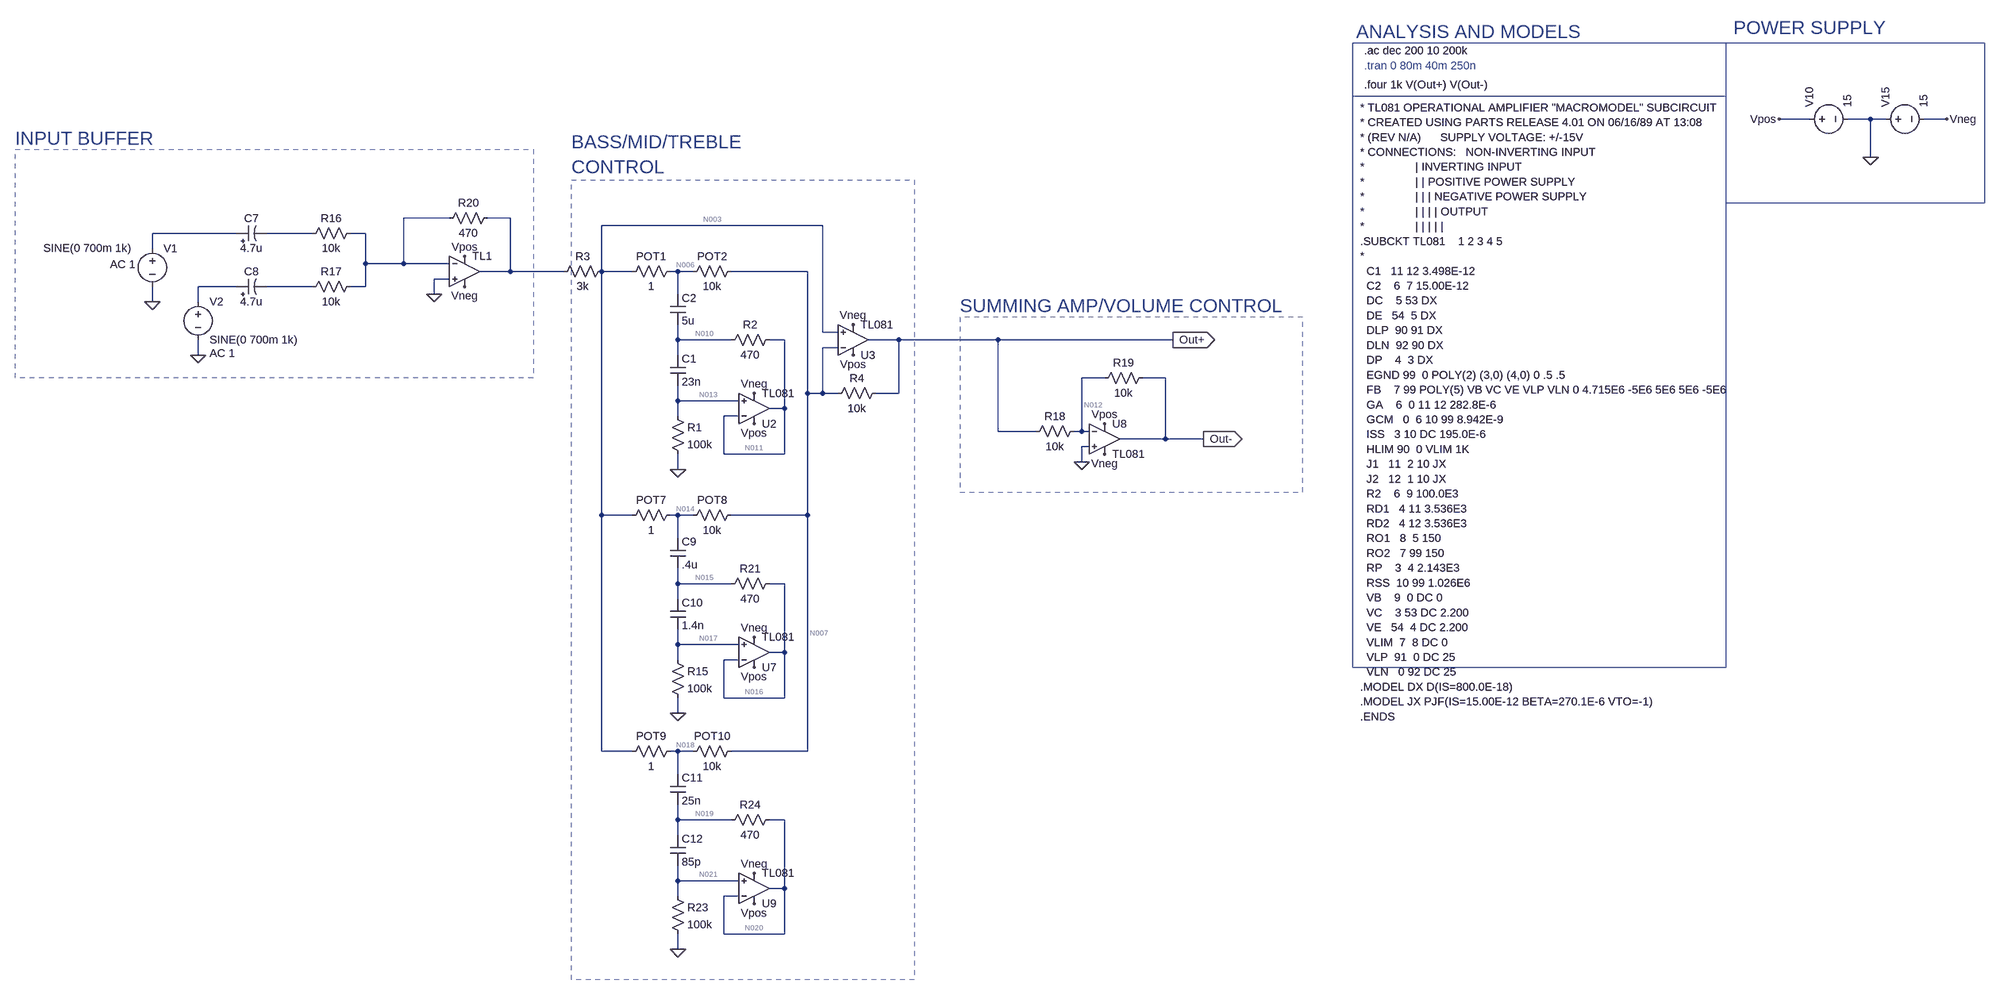
[diagram p0: schematic Equaliser.asc]
Equaliser.asc, the LTspice schematic file:
Version 4.1
SHEET 1 4836 2132
WIRE 4464 -336 4400 -336
WIRE 4592 -336 4544 -336
WIRE 4624 -336 4592 -336
WIRE 4752 -336 4704 -336
WIRE 4592 -256 4592 -336
WIRE 1152 -128 1056 -128
WIRE 1280 -128 1232 -128
WIRE 1936 -112 1472 -112
WIRE 704 -96 528 -96
WIRE 864 -96 768 -96
WIRE 976 -96 944 -96
WIRE 528 -64 528 -96
WIRE 976 -32 976 -96
WIRE 1056 -32 1056 -128
WIRE 1056 -32 976 -32
WIRE 1152 -32 1056 -32
WIRE 1280 -16 1280 -128
WIRE 1280 -16 1216 -16
WIRE 1392 -16 1280 -16
WIRE 1472 -16 1472 -112
WIRE 1536 -16 1472 -16
WIRE 1632 -16 1616 -16
WIRE 1664 -16 1632 -16
WIRE 1904 -16 1744 -16
WIRE 1152 0 1120 0
WIRE 704 16 624 16
WIRE 864 16 768 16
WIRE 976 16 976 -32
WIRE 976 16 944 16
WIRE 1120 32 1120 0
WIRE 1632 32 1632 -16
WIRE 528 48 528 16
WIRE 624 48 624 16
WIRE 1936 112 1936 -112
WIRE 1968 112 1936 112
WIRE 1632 128 1632 96
WIRE 1744 128 1632 128
WIRE 1856 128 1824 128
WIRE 2096 128 2032 128
WIRE 2304 128 2096 128
WIRE 2672 128 2304 128
WIRE 1968 144 1936 144
WIRE 624 160 624 128
WIRE 1632 160 1632 128
WIRE 2528 208 2480 208
WIRE 2656 208 2608 208
WIRE 1904 240 1904 -16
WIRE 1936 240 1936 144
WIRE 1936 240 1904 240
WIRE 1968 240 1936 240
WIRE 2096 240 2096 128
WIRE 2096 240 2048 240
WIRE 1632 256 1632 224
WIRE 1760 256 1632 256
WIRE 1856 272 1856 128
WIRE 1856 272 1824 272
WIRE 1632 288 1632 256
WIRE 1760 288 1728 288
WIRE 2304 320 2304 128
WIRE 2384 320 2304 320
WIRE 2480 320 2480 208
WIRE 2480 320 2464 320
WIRE 2496 320 2480 320
WIRE 2656 336 2656 208
WIRE 2656 336 2560 336
WIRE 2736 336 2656 336
WIRE 2496 352 2480 352
WIRE 1728 368 1728 288
WIRE 1856 368 1856 272
WIRE 1856 368 1728 368
WIRE 2480 384 2480 352
WIRE 1632 400 1632 368
WIRE 1472 496 1472 -16
WIRE 1536 496 1472 496
WIRE 1632 496 1616 496
WIRE 1664 496 1632 496
WIRE 1904 496 1904 240
WIRE 1904 496 1744 496
WIRE 1632 544 1632 496
WIRE 1632 640 1632 608
WIRE 1744 640 1632 640
WIRE 1856 640 1824 640
WIRE 1632 672 1632 640
WIRE 1632 768 1632 736
WIRE 1760 768 1632 768
WIRE 1856 784 1856 640
WIRE 1856 784 1824 784
WIRE 1632 800 1632 768
WIRE 1760 800 1728 800
WIRE 1728 880 1728 800
WIRE 1856 880 1856 784
WIRE 1856 880 1728 880
WIRE 1632 912 1632 880
WIRE 1472 992 1472 496
WIRE 1536 992 1472 992
WIRE 1632 992 1616 992
WIRE 1664 992 1632 992
WIRE 1904 992 1904 496
WIRE 1904 992 1744 992
WIRE 1632 1040 1632 992
WIRE 1632 1136 1632 1104
WIRE 1744 1136 1632 1136
WIRE 1856 1136 1824 1136
WIRE 1632 1168 1632 1136
WIRE 1632 1264 1632 1232
WIRE 1760 1264 1632 1264
WIRE 1856 1280 1856 1136
WIRE 1856 1280 1824 1280
WIRE 1632 1296 1632 1264
WIRE 1760 1296 1728 1296
WIRE 1728 1376 1728 1296
WIRE 1856 1376 1856 1280
WIRE 1856 1376 1728 1376
WIRE 1632 1408 1632 1376
FLAG 1632 400 0
FLAG 4592 -256 0
FLAG 4400 -336 Vpos
FLAG 4752 -336 Vneg
FLAG 1792 240 Vneg
FLAG 2000 96 Vneg
FLAG 1792 304 Vpos
FLAG 2000 160 Vpos
FLAG 2672 128 Out+
IOPIN 2672 128 Out
FLAG 2736 336 Out-
IOPIN 2736 336 Out
FLAG 2528 304 Vpos
FLAG 2528 368 Vneg
FLAG 2480 384 0
FLAG 528 48 0
FLAG 624 160 0
FLAG 1120 32 0
FLAG 1184 -48 Vpos
FLAG 1184 16 Vneg
FLAG 1632 912 0
FLAG 1792 752 Vneg
FLAG 1792 816 Vpos
FLAG 1632 1408 0
FLAG 1792 1248 Vneg
FLAG 1792 1312 Vpos
SYMBOL res 1488 -32 R90
WINDOW 0 0 56 VBottom 2
WINDOW 3 32 56 VTop 2
SYMATTR InstName R3
SYMATTR Value 3k
SYMBOL res 1632 -32 R90
WINDOW 0 0 56 VBottom 2
WINDOW 3 32 56 VTop 2
SYMATTR InstName POT1
SYMATTR Value 1
SYMBOL res 1760 -32 R90
WINDOW 0 0 56 VBottom 2
WINDOW 3 32 56 VTop 2
SYMATTR InstName POT2
SYMATTR Value 10k
SYMBOL cap 1616 32 R0
SYMATTR InstName C2
SYMATTR Value 5u
SYMBOL cap 1616 160 R0
SYMATTR InstName C1
SYMATTR Value 23n
SYMBOL res 1616 272 R0
SYMATTR InstName R1
SYMATTR Value 100k
SYMBOL res 1840 112 R90
WINDOW 0 0 56 VBottom 2
WINDOW 3 32 56 VTop 2
SYMATTR InstName R2
SYMATTR Value 470
SYMBOL res 2064 224 R90
WINDOW 0 0 56 VBottom 2
WINDOW 3 32 56 VTop 2
SYMATTR InstName R4
SYMATTR Value 10k
SYMBOL OpAmps\\opamp2 1792 336 M180
SYMATTR InstName U2
SYMATTR Value TL081
SYMBOL OpAmps\\opamp2 2000 192 M180
SYMATTR InstName U3
SYMATTR Value TL081
SYMBOL voltage 4448 -336 R270
WINDOW 123 0 0 Left 0
WINDOW 39 0 0 Left 0
SYMATTR InstName V10
SYMATTR Value 15
SYMBOL voltage 4608 -336 R270
WINDOW 123 0 0 Left 0
WINDOW 39 0 0 Left 0
SYMATTR InstName V15
SYMATTR Value 15
SYMBOL OpAmps\\opamp2 2528 272 R0
SYMATTR InstName U8
SYMATTR Value TL081
SYMBOL res 2480 304 R90
WINDOW 0 0 56 VBottom 2
WINDOW 3 32 56 VTop 2
SYMATTR InstName R18
SYMATTR Value 10k
SYMBOL res 2624 192 R90
WINDOW 0 0 56 VBottom 2
WINDOW 3 32 56 VTop 2
SYMATTR InstName R19
SYMATTR Value 10k
SYMBOL voltage 528 -80 R0
WINDOW 3 -229 15 Left 2
WINDOW 123 -89 49 Left 2
WINDOW 39 0 0 Left 0
SYMATTR Value SINE(0 700m 1k)
SYMATTR Value2 AC 1
SYMATTR InstName V1
SYMBOL voltage 624 32 R0
WINDOW 123 24 124 Left 2
WINDOW 39 0 0 Left 0
SYMATTR Value2 AC 1
SYMATTR InstName V2
SYMATTR Value SINE(0 700m 1k)
SYMBOL polcap 704 -80 R270
WINDOW 0 32 32 VTop 2
WINDOW 3 0 32 VBottom 2
SYMATTR InstName C7
SYMATTR Value 4.7u
SYMBOL polcap 704 32 R270
WINDOW 0 32 32 VTop 2
WINDOW 3 0 32 VBottom 2
SYMATTR InstName C8
SYMATTR Value 4.7u
SYMBOL res 960 -112 R90
WINDOW 0 0 56 VBottom 2
WINDOW 3 32 56 VTop 2
SYMATTR InstName R16
SYMATTR Value 10k
SYMBOL res 960 0 R90
WINDOW 0 0 56 VBottom 2
WINDOW 3 32 56 VTop 2
SYMATTR InstName R17
SYMATTR Value 10k
SYMBOL OpAmps\\UniversalOpAmp2 1184 -16 R0
SYMATTR InstName TL1
SYMBOL res 1248 -144 R90
WINDOW 0 0 56 VBottom 2
WINDOW 3 32 56 VTop 2
SYMATTR InstName R20
SYMATTR Value 470
SYMATTR SpiceLine tol=5
SYMBOL res 1632 480 R90
WINDOW 0 0 56 VBottom 2
WINDOW 3 32 56 VTop 2
SYMATTR InstName POT7
SYMATTR Value 1
SYMBOL res 1760 480 R90
WINDOW 0 0 56 VBottom 2
WINDOW 3 32 56 VTop 2
SYMATTR InstName POT8
SYMATTR Value 10k
SYMBOL cap 1616 544 R0
SYMATTR InstName C9
SYMATTR Value .4u
SYMBOL cap 1616 672 R0
SYMATTR InstName C10
SYMATTR Value 1.4n
SYMBOL res 1616 784 R0
SYMATTR InstName R15
SYMATTR Value 100k
SYMBOL res 1840 624 R90
WINDOW 0 0 56 VBottom 2
WINDOW 3 32 56 VTop 2
SYMATTR InstName R21
SYMATTR Value 470
SYMBOL OpAmps\\opamp2 1792 848 M180
SYMATTR InstName U7
SYMATTR Value TL081
SYMBOL res 1632 976 R90
WINDOW 0 0 56 VBottom 2
WINDOW 3 32 56 VTop 2
SYMATTR InstName POT9
SYMATTR Value 1
SYMBOL res 1760 976 R90
WINDOW 0 0 56 VBottom 2
WINDOW 3 32 56 VTop 2
SYMATTR InstName POT10
SYMATTR Value 10k
SYMBOL cap 1616 1040 R0
SYMATTR InstName C11
SYMATTR Value 25n
SYMBOL cap 1616 1168 R0
SYMATTR InstName C12
SYMATTR Value 85p
SYMBOL res 1616 1280 R0
SYMATTR InstName R23
SYMATTR Value 100k
SYMBOL res 1840 1120 R90
WINDOW 0 0 56 VBottom 2
WINDOW 3 32 56 VTop 2
SYMATTR InstName R24
SYMATTR Value 470
SYMBOL OpAmps\\opamp2 1792 1344 M180
SYMATTR InstName U9
SYMATTR Value TL081
TEXT 3528 -480 Left 2 !.ac dec 200 10 200k
TEXT 3528 -448 Left 2 ;.tran 0 80m 40m 250n
TEXT 3520 -360 Left 2 !* TL081 OPERATIONAL AMPLIFIER "MACROMODEL" SUBCIRCUIT\n* CREATED USING PARTS RELEASE 4.01 ON 06/16/89 AT 13:08\n* (REV N/A)      SUPPLY VOLTAGE: +/-15V\n* CONNECTIONS:   NON-INVERTING INPUT\n*                | INVERTING INPUT\n*                | | POSITIVE POWER SUPPLY\n*                | | | NEGATIVE POWER SUPPLY\n*                | | | | OUTPUT\n*                | | | | |\n.SUBCKT TL081    1 2 3 4 5\n*\n  C1   11 12 3.498E-12\n  C2    6  7 15.00E-12\n  DC    5 53 DX\n  DE   54  5 DX\n  DLP  90 91 DX\n  DLN  92 90 DX\n  DP    4  3 DX\n  EGND 99  0 POLY(2) (3,0) (4,0) 0 .5 .5\n  FB    7 99 POLY(5) VB VC VE VLP VLN 0 4.715E6 -5E6 5E6 5E6 -5E6\n  GA    6  0 11 12 282.8E-6\n  GCM   0  6 10 99 8.942E-9\n  ISS   3 10 DC 195.0E-6\n  HLIM 90  0 VLIM 1K\n  J1   11  2 10 JX\n  J2   12  1 10 JX\n  R2    6  9 100.0E3\n  RD1   4 11 3.536E3\n  RD2   4 12 3.536E3\n  RO1   8  5 150\n  RO2   7 99 150\n  RP    3  4 2.143E3\n  RSS  10 99 1.026E6\n  VB    9  0 DC 0\n  VC    3 53 DC 2.200\n  VE   54  4 DC 2.200\n  VLIM  7  8 DC 0\n  VLP  91  0 DC 25\n  VLN   0 92 DC 25\n.MODEL DX D(IS=800.0E-18)\n.MODEL JX PJF(IS=15.00E-12 BETA=270.1E-6 VTO=-1)\n.ENDS
TEXT 3528 -408 Left 2 !.four 1k V(Out+) V(Out-)
TEXT 240 -296 Left 4 ;INPUT BUFFER
TEXT 2224 56 Left 4 ;SUMMING AMP/VOLUME CONTROL
TEXT 3512 -520 Left 4 ;ANALYSIS AND MODELS
TEXT 4304 -528 Left 4 ;POWER SUPPLY
TEXT 1408 -288 Left 4 ;BASS/MID/TREBLE\nCONTROL
RECTANGLE Normal 1328 208 240 -272 3
RECTANGLE Normal 4288 816 3504 -384
RECTANGLE Normal 4288 -384 3504 -496
RECTANGLE Normal 4832 -496 4288 -160
RECTANGLE Normal 2224 448 2944 80 3
RECTANGLE Normal 2128 1472 1408 -208 3

The netlist it stands for:
* Equaliser.asc
R3 N003 N002 3k
R§POT1 N006 N003 1
R§POT2 N007 N006 10k
C2 N006 N010 5u
C1 N010 N013 23n
R1 N013 0 100k
R2 N011 N010 470
R4 Out+ N007 10k
X§U2 N013 N011 Vpos Vneg N011 TL081  ; pins In+ In- V+ V- OUT
X§U3 N003 N007 Vpos Vneg Out+ TL081  ; pins In+ In- V+ V- OUT
V10 Vpos 0 15
V15 0 Vneg 15
X§U8 0 N012 Vpos Vneg Out- TL081  ; pins In+ In- V+ V- OUT
R18 N012 Out+ 10k
R19 Out- N012 10k
V1 N004 0 SINE(0 700m 1k) AC 1
V2 N008 0 SINE(0 700m 1k) AC 1
C7 N004 N005 4.7u
C8 N008 N009 4.7u
R16 N001 N005 10k
R17 N001 N009 10k
X§TL1 0 N001 Vpos Vneg N002 level2 Avol=1Meg GBW=10Meg Slew=10Meg Ilimit=25m Rail=0 Vos=0 En=0 Enk=0 In=0 Ink=0 Rin=500Meg  ; pins In+ In- V+ V- OUT
R20 N002 N001 470 tol=5
R§POT7 N014 N003 1
R§POT8 N007 N014 10k
C9 N014 N015 .4u
C10 N015 N017 1.4n
R15 N017 0 100k
R21 N016 N015 470
X§U7 N017 N016 Vpos Vneg N016 TL081  ; pins In+ In- V+ V- OUT
R§POT9 N018 N003 1
R§POT10 N007 N018 10k
C11 N018 N019 25n
C12 N019 N021 85p
R23 N021 0 100k
R24 N020 N019 470
X§U9 N021 N020 Vpos Vneg N020 TL081  ; pins In+ In- V+ V- OUT
.ac dec 200 10 200k
* .tran 0 80m 40m 250n
* TL081 OPERATIONAL AMPLIFIER "MACROMODEL" SUBCIRCUIT
* CREATED USING PARTS RELEASE 4.01 ON 06/16/89 AT 13:08
* (REV N/A)      SUPPLY VOLTAGE: +/-15V
* CONNECTIONS:   NON-INVERTING INPUT
*                | INVERTING INPUT
*                | | POSITIVE POWER SUPPLY
*                | | | NEGATIVE POWER SUPPLY
*                | | | | OUTPUT
*                | | | | |
.SUBCKT TL081    1 2 3 4 5
*
  C1   11 12 3.498E-12
  C2    6  7 15.00E-12
  DC    5 53 DX
  DE   54  5 DX
  DLP  90 91 DX
  DLN  92 90 DX
  DP    4  3 DX
  EGND 99  0 POLY(2) (3,0) (4,0) 0 .5 .5
  FB    7 99 POLY(5) VB VC VE VLP VLN 0 4.715E6 -5E6 5E6 5E6 -5E6
  GA    6  0 11 12 282.8E-6
  GCM   0  6 10 99 8.942E-9
  ISS   3 10 DC 195.0E-6
  HLIM 90  0 VLIM 1K
  J1   11  2 10 JX
  J2   12  1 10 JX
  R2    6  9 100.0E3
  RD1   4 11 3.536E3
  RD2   4 12 3.536E3
  RO1   8  5 150
  RO2   7 99 150
  RP    3  4 2.143E3
  RSS  10 99 1.026E6
  VB    9  0 DC 0
  VC    3 53 DC 2.200
  VE   54  4 DC 2.200
  VLIM  7  8 DC 0
  VLP  91  0 DC 25
  VLN   0 92 DC 25
.MODEL DX D(IS=800.0E-18)
.MODEL JX PJF(IS=15.00E-12 BETA=270.1E-6 VTO=-1)
.ENDS
.four 1k V(Out+) V(Out-)
* INPUT BUFFER
* SUMMING AMP/VOLUME CONTROL
* ANALYSIS AND MODELS
* POWER SUPPLY
* BASS/MID/TREBLE
* CONTROL
.lib UniversalOpAmp2.lib
.backanno
.end

* Results of the author's LTspice run, read from the files saved beside the schematic
* Operating Point, zero values left out:
*   V(n003) = 9.737 µV
*   V(n006) = 9.738 µV
*   V(n007) = 20.71 µV
*   V(n010) = 6.465 µV
*   V(n011) = 6.465 µV
*   V(n012) = 10.97 µV
*   V(n013) = -4.505 µV
*   V(n014) = 9.738 µV
*   V(n015) = 6.465 µV
*   V(n016) = 6.465 µV
*   V(n017) = -4.505 µV
*   V(n018) = 9.738 µV
*   V(n019) = 6.465 µV
*   V(n020) = 6.465 µV
*   V(n021) = -4.505 µV
*   V(out+) = 54.06 µV
*   V(out-) = -31.67 µV
*   V(vneg) = -15 V
*   V(vpos) = 15 V
*   I(POT1) = 1.097 nA
*   I(POT10) = 1.097 nA
*   I(POT2) = 1.097 nA
*   I(POT7) = 1.097 nA
*   I(POT8) = 1.097 nA
*   I(POT9) = 1.097 nA
*   I(R1) = -45.05 pA
*   I(R15) = -45.05 pA
*   I(R18) = -4.309 nA
*   I(R19) = -4.264 nA
*   I(R23) = -45.05 pA
*   I(R3) = 3.246 nA
*   I(R4) = 3.336 nA
*   I(V10) = -72.47 mA
*   I(V15) = -72.47 mA
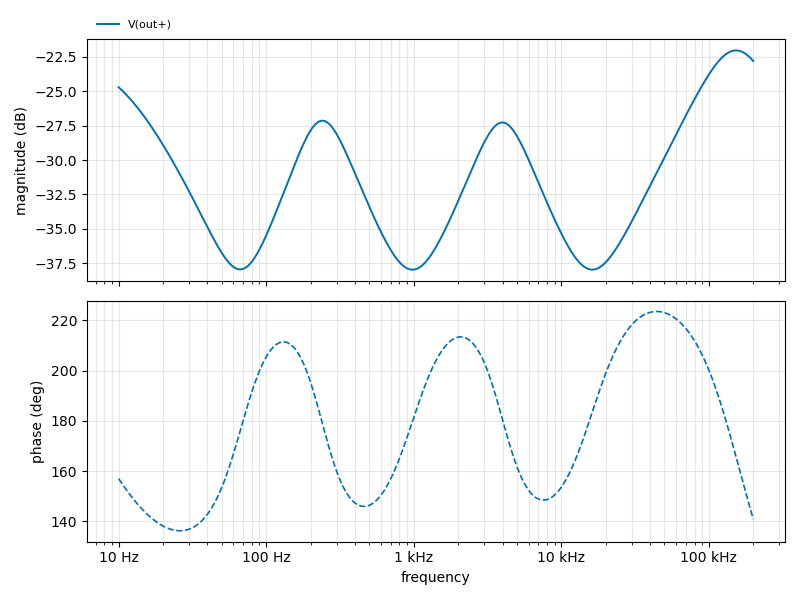
[diagram p1: AC Analysis of Equaliser.asc, plotted from the saved traces]
* AC Analysis, 1 run:
*   V(out+): -24.72 dB at 10 Hz, -22.83 dB at 200 kHz, peak -22.05 dB at 153.1 kHz, 3 dB below the peak at 85.09 kHz